# EAGLE board dt-rev-b (EAGLE 9.6.2)
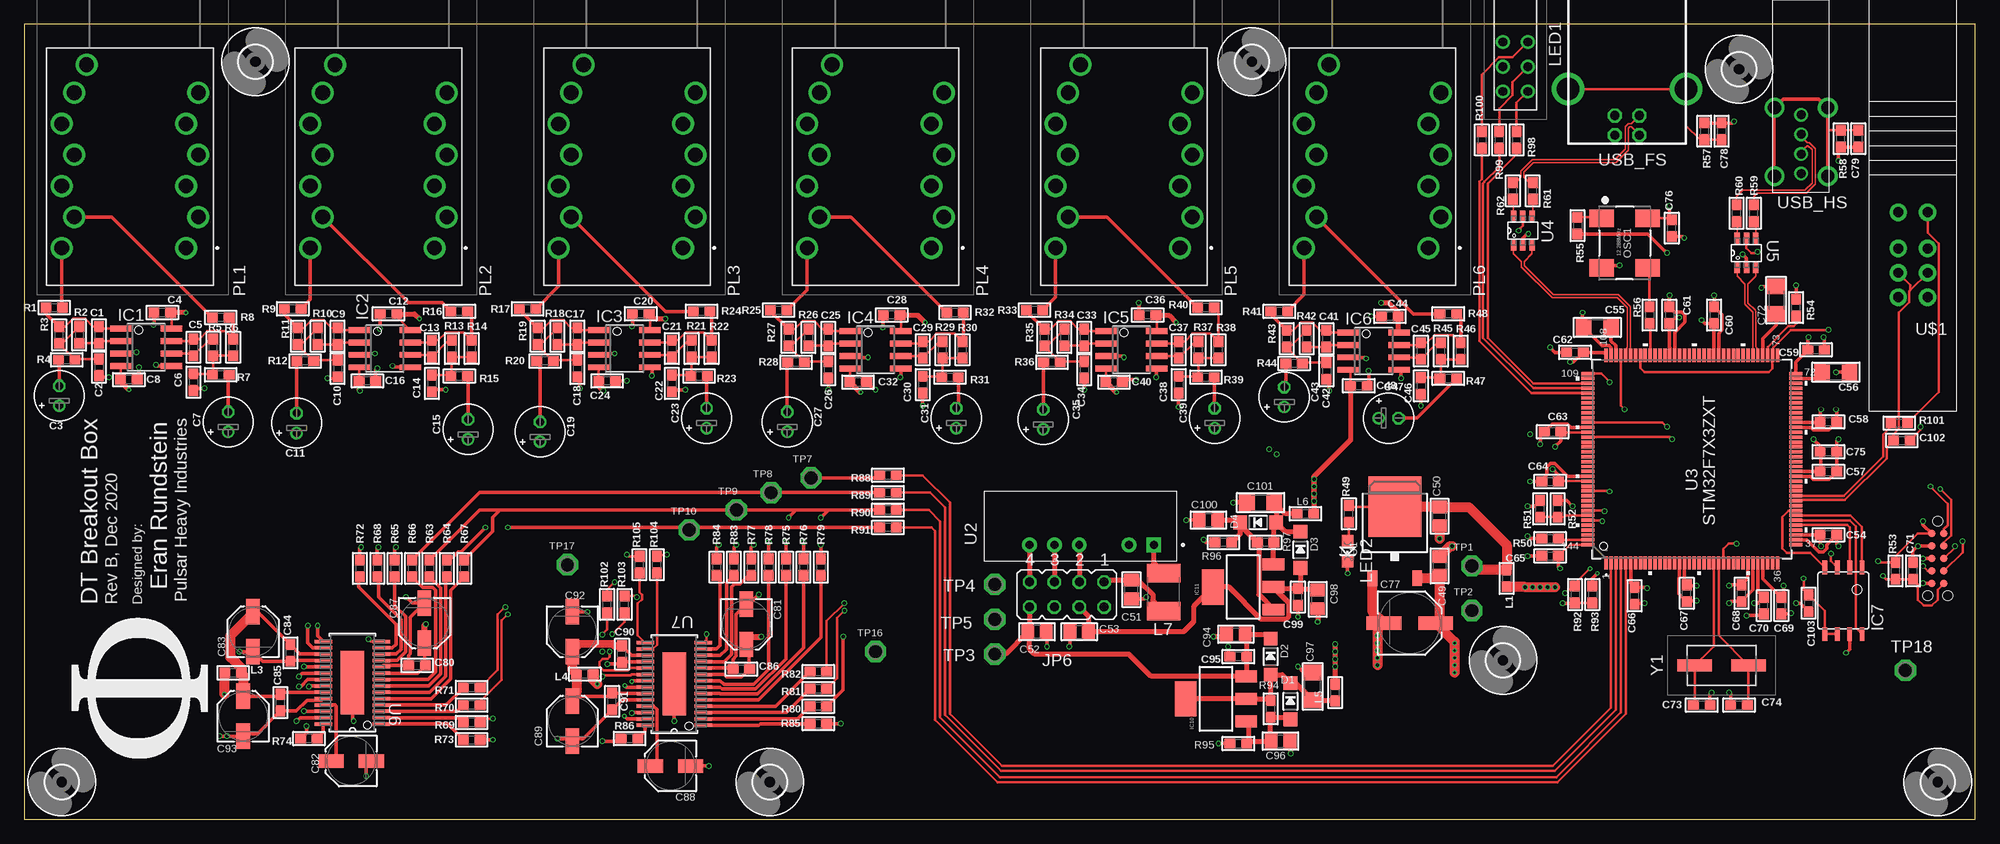
[diagram p4: board, top side]
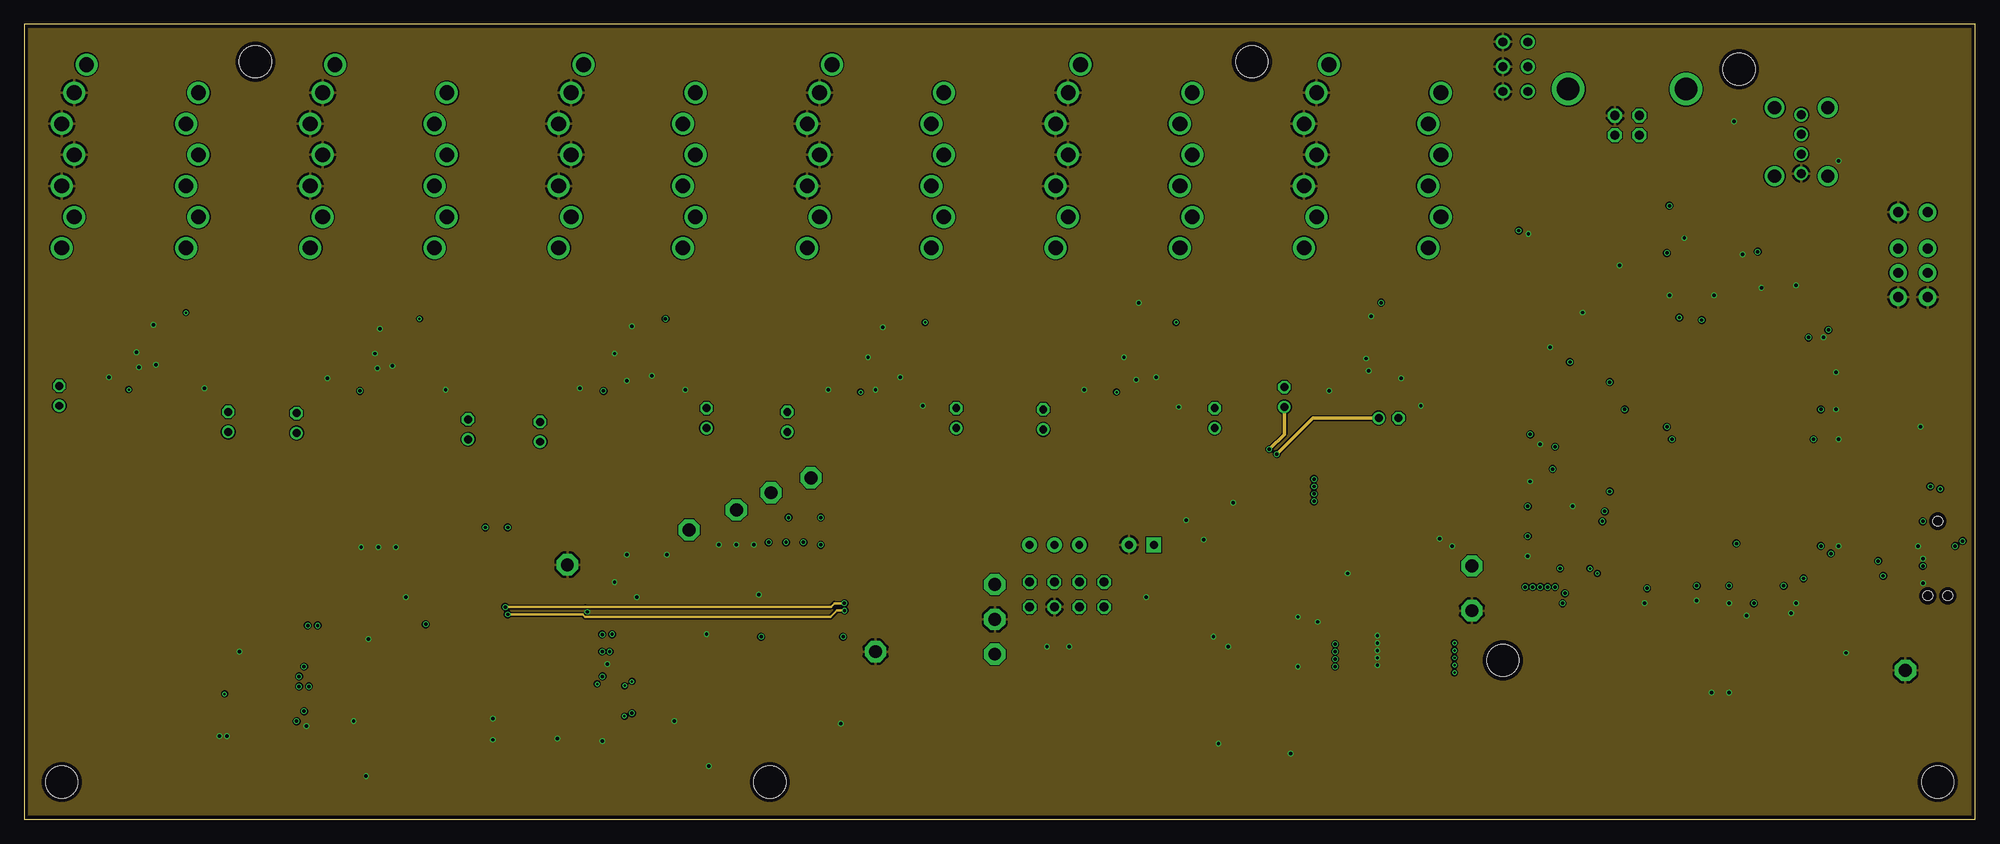
[diagram p5: board, inner layer Route2]
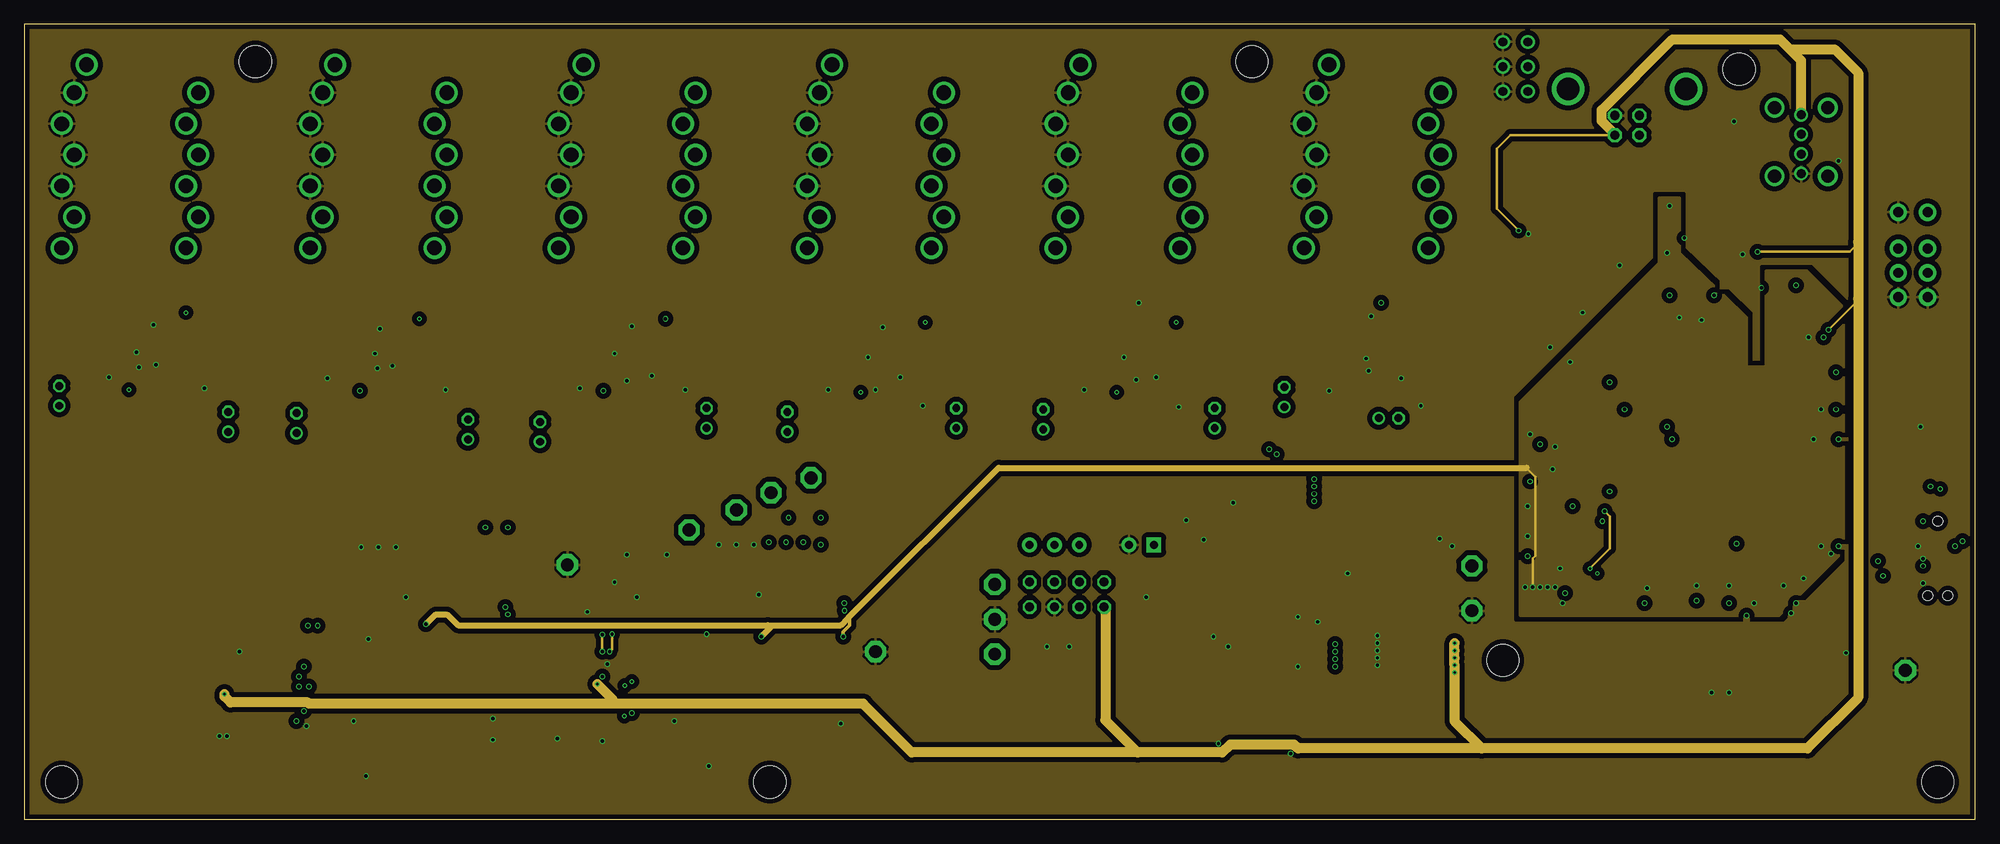
[diagram p6: board, inner layer Route15]
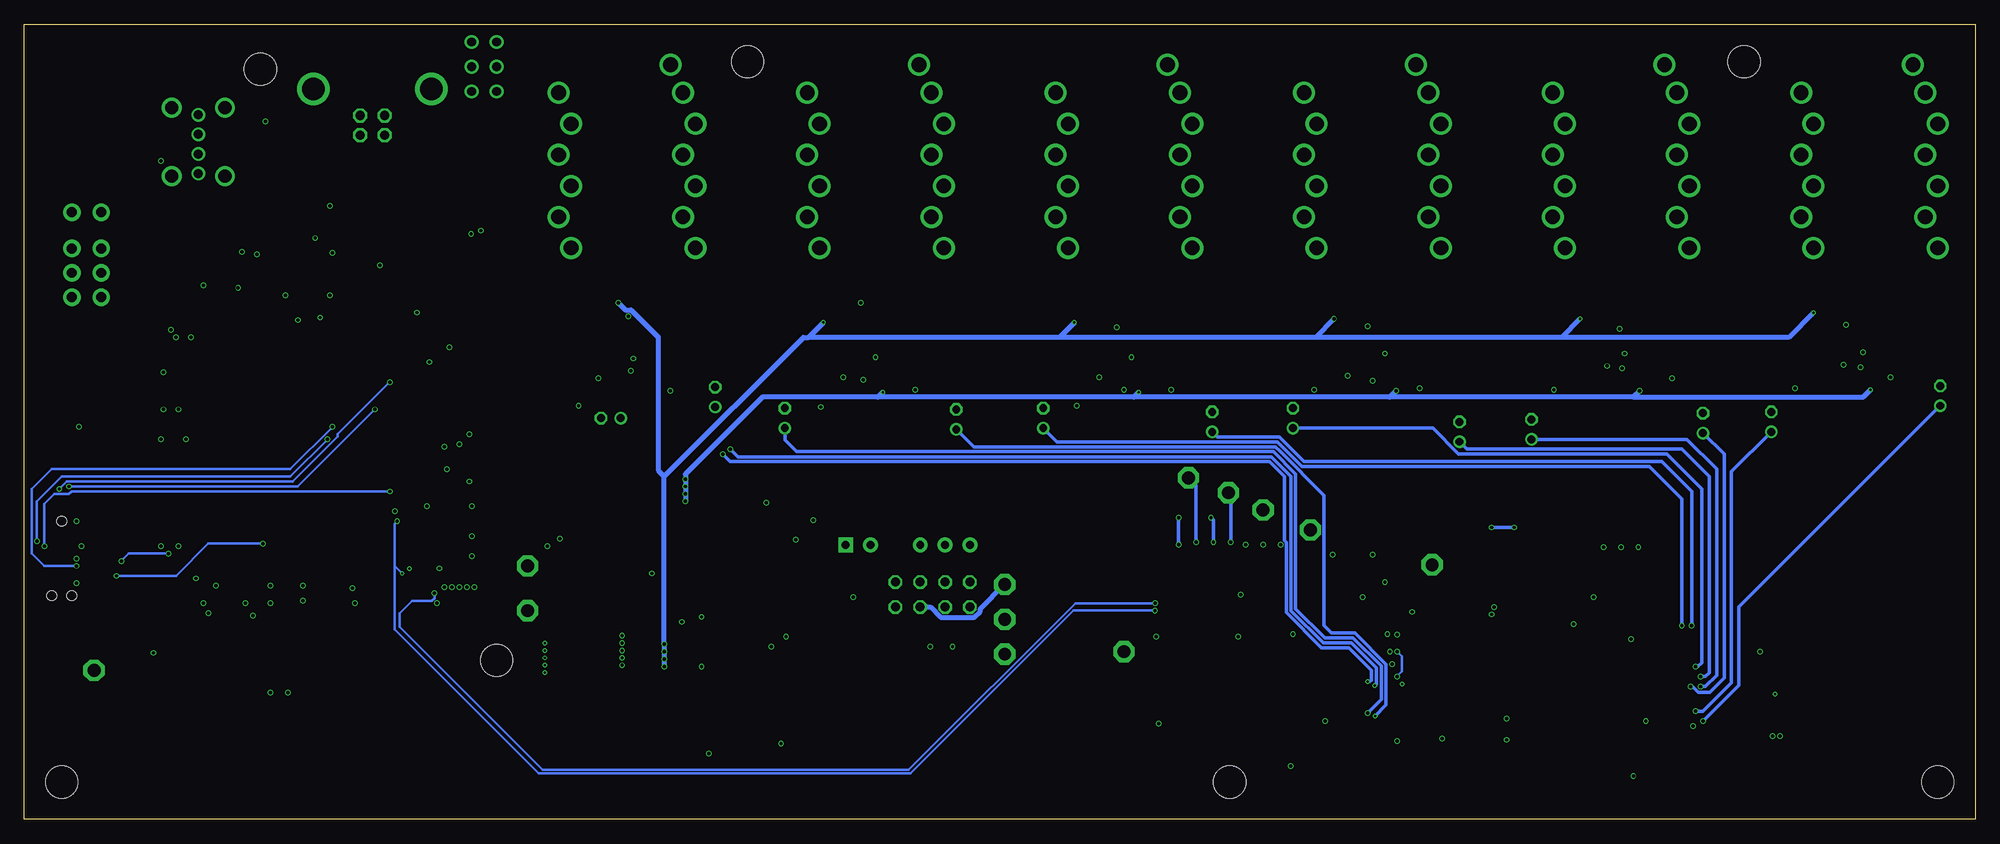
[diagram p7: board, bottom side, seen from below]

Size 199.39 x 81.28 mm. Coordinates in mm from the lower left corner, seen from the top.
Outline: 0,0 199.39,0 199.39,81.28 0,81.28 0,0
Copper layers (1+2*15+16): Top 0.035559375mm / dielectric 0.17018125mm / Route2 0.01778125mm / dielectric 47mil / Route15 0.01778125mm / dielectric 0.17018125mm / Bottom 0.035559375mm
Design rules "oshpark-4layer *": minimum track width 5mil, minimum drill 10mil, track to track 5mil, track to pad 5mil, pad to pad 5mil, via to via 5mil, smd to smd 5mil, copper to edge 15mil, drill to drill 6mil, minimum pad ring 4mil, minimum via ring 4mil, stop-mask expansion 1.5mil, vias tented up to drill 20mil, thermal gap 10mil
Net classes: 1 USB: width 0.152 mm, clearance 0.152 mm

## Footprints (pad centres in the part's own frame; a part is rotated, then mirrored left to right if it is on the bottom)
0603 = smd 1.1 x 1: 1 -0.85,0; 2 0.85,0
E2-5 = drill 0.813 pad 1.27: + -1.016,0 | drill 0.813 pad 1.27 octagon: - 1.016,0
0805 = smd 1.3 x 1.5: 1 -0.95,0; 2 0.95,0
1206 = smd 1.6 x 1.8: 1 -1.4,0; 2 1.4,0
PANASONIC_D = smd 3.556 x 1.4: + 2.654,0; - -2.654,0
PANASONIC_C = smd 2.6 x 1.4: + 2.05,0; - -2.05,0
SOD-123 = smd 1.4 x 1.4: A 1.85,0; C -1.85,0
3,3 = hole 3.3: 0,0
SO08 = smd 0.6 x 2.2: 1 -1.905,-2.6; 2 -0.635,-2.6; 3 0.635,-2.6; 4 1.905,-2.6; 5 1.905,2.6; 6 0.635,2.6; 7 -0.635,2.6; 8 -1.905,2.6
SOIC8 = smd 0.5 x 1.4: 1 -1.905,-3.404; 2 -0.645,-3.404; 3 0.625,-3.404; 4 1.895,-3.404; 5 1.905,3.404; 6 0.635,3.404; 7 -0.635,3.404; 8 -1.905,3.404
SOT223 = smd 1.219 x 2.235: 1 -2.311,-3.099; 2 0,-3.099; 3 2.311,-3.099 | smd 3.6 x 2.2: 4 0,3.099
JP4Q = drill 0.914 octagon: 1 -3.81,-1.27; 2 -3.81,1.27; 3 -1.27,-1.27; 4 -1.27,1.27; 5 1.27,-1.27; 6 1.27,1.27; 7 3.81,-1.27; 8 3.81,1.27
L1812 = smd 1.9 x 3.4: 1 -1.95,0; 2 1.95,0
WP934SALILYLGD = drill 0.889 pad 1.4: A1 5.08,2.54; A2 2.54,2.54; A3 0,2.54; C1 5.08,0; C2 2.54,0; C3 0,0
CHIPLED_0805 = smd 1.2 x 1.2: A 0,-1.05; C 0,1.05
OSC_7X5MM = smd 1.8 x 2.5: 1 -2.54,-2.35; 2 2.54,-2.35; 3 2.54,2.35; 4 -2.54,2.35
NSJ12HF1 = drill 1.5 pad 2.25: 1 0,0; 2 3.18,-1.27; 3 6.35,0; 4 9.53,-1.27; 5 12.7,0; 6 15.874,-1.27; 7 18.75,10.16; 8 15.874,11.43; 9 12.7,12.7; 10 9.53,11.43; 11 6.35,12.7; 12 3.18,11.43; 13 0,12.7
TC2050-IDC-NL = smd 0.787 x 0.787: 1 -2.54,-0.635; 2 -2.54,0.635; 3 -1.27,-0.635; 4 -1.27,0.635; 5 0,-0.635; 6 0,0.635; 7 1.27,-0.635; 8 1.27,0.635; 9 2.54,-0.635; 10 2.54,0.635 | hole 0.991: -3.81,0; 3.81,1.016; 3.81,-1.016
P1-13 = drill 1.321 pad 2.159 octagon: TP 0,0
TO252 = smd 1 x 1.6: 1 -2.28,-4.8; 2 2.28,-4.8 | smd 5.4 x 6.2: 3 0,2.5
CONV_PCN2-S5-D12-S = drill 0.8 pad 1.5 square: 1 0,0 | drill 0.8 pad 1.5: 2 2.54,0; 4 7.62,0; 5 10.16,0; 6 12.7,0
LQFP144-20X20MM = smd 1.346 x 0.356: 1 -10.625,8.75; 2 -10.625,8.25; 3 -10.625,7.75; 4 -10.625,7.25; 5 -10.625,6.75; 6 -10.625,6.25; 7 -10.625,5.75; 8 -10.625,5.25; 9 -10.625,4.75; 10 -10.625,4.25; 11 -10.625,3.75; 12 -10.625,3.25; 13 -10.625,2.75; 14 -10.625,2.25; 15 -10.625,1.75; 16 -10.625,1.25; 17 -10.625,0.75; 18 -10.625,0.25; 19 -10.625,-0.25; 20 -10.625,-0.75; 21 -10.625,-1.25; 22 -10.625,-1.75; 23 -10.625,-2.25; 24 -10.625,-2.75; 25 -10.625,-3.25; 26 -10.625,-3.75; 27 -10.625,-4.25; 28 -10.625,-4.75; 29 -10.625,-5.25; 30 -10.625,-5.75; 31 -10.625,-6.25; 32 -10.625,-6.75; 33 -10.625,-7.25; 34 -10.625,-7.75; 35 -10.625,-8.25; 36 -10.625,-8.75; 73 10.625,-8.75; 74 10.625,-8.25; 75 10.625,-7.75; 76 10.625,-7.25; 77 10.625,-6.75; 78 10.625,-6.25; 79 10.625,-5.75; 80 10.625,-5.25; 81 10.625,-4.75; 82 10.625,-4.25; 83 10.625,-3.75; 84 10.625,-3.25; 85 10.625,-2.75; 86 10.625,-2.25; 87 10.625,-1.75; 88 10.625,-1.25; 89 10.625,-0.75; 90 10.625,-0.25; 91 10.625,0.25; 92 10.625,0.75; 93 10.625,1.25; 94 10.625,1.75; 95 10.625,2.25; 96 10.625,2.75; 97 10.625,3.25; 98 10.625,3.75; 99 10.625,4.25; 100 10.625,4.75; 101 10.625,5.25; 102 10.625,5.75; 103 10.625,6.25; 104 10.625,6.75; 105 10.625,7.25; 106 10.625,7.75; 107 10.625,8.25; 108 10.625,8.75 | smd 0.356 x 1.346: 37 -8.75,-10.625; 38 -8.25,-10.625; 39 -7.75,-10.625; 40 -7.25,-10.625; 41 -6.75,-10.625; 42 -6.25,-10.625; 43 -5.75,-10.625; 44 -5.25,-10.625; 45 -4.75,-10.625; 46 -4.25,-10.625; 47 -3.75,-10.625; 48 -3.25,-10.625; 49 -2.75,-10.625; 50 -2.25,-10.625; 51 -1.75,-10.625; 52 -1.25,-10.625; 53 -0.75,-10.625; 54 -0.25,-10.625; 55 0.25,-10.625; 56 0.75,-10.625; 57 1.25,-10.625; 58 1.75,-10.625; 59 2.25,-10.625; 60 2.75,-10.625; 61 3.25,-10.625; 62 3.75,-10.625; 63 4.25,-10.625; 64 4.75,-10.625; 65 5.25,-10.625; 66 5.75,-10.625; 67 6.25,-10.625; 68 6.75,-10.625; 69 7.25,-10.625; 70 7.75,-10.625; 71 8.25,-10.625; 72 8.75,-10.625; 109 8.75,10.625; 110 8.25,10.625; 111 7.75,10.625; 112 7.25,10.625; 113 6.75,10.625; 114 6.25,10.625; 115 5.75,10.625; 116 5.25,10.625; 117 4.75,10.625; 118 4.25,10.625; 119 3.75,10.625; 120 3.25,10.625; 121 2.75,10.625; 122 2.25,10.625; 123 1.75,10.625; 124 1.25,10.625; 125 0.75,10.625; 126 0.25,10.625; 127 -0.25,10.625; 128 -0.75,10.625; 129 -1.25,10.625; 130 -1.75,10.625; 131 -2.25,10.625; 132 -2.75,10.625; 133 -3.25,10.625; 134 -3.75,10.625; 135 -4.25,10.625; 136 -4.75,10.625; 137 -5.25,10.625; 138 -5.75,10.625; 139 -6.25,10.625; 140 -6.75,10.625; 141 -7.25,10.625; 142 -7.75,10.625; 143 -8.25,10.625; 144 -8.75,10.625
SOT23-6L_STM-M = smd 1.181 x 0.559: 1 -1.467,0.95; 2 -1.467,0; 3 -1.467,-0.95; 4 1.467,-0.95; 5 1.467,0; 6 1.467,0.95
PWP28_6P46X2P4-M = smd 1.778 x 0.356: 1 -2.972,4.225; 2 -2.972,3.575; 3 -2.972,2.925; 4 -2.972,2.275; 5 -2.972,1.625; 6 -2.972,0.975; 7 -2.972,0.325; 8 -2.972,-0.325; 9 -2.972,-0.975; 10 -2.972,-1.625; 11 -2.972,-2.275; 12 -2.972,-2.925; 13 -2.972,-3.575; 14 -2.972,-4.225; 15 2.972,-4.225; 16 2.972,-3.575; 17 2.972,-2.925; 18 2.972,-2.275; 19 2.972,-1.625; 20 2.972,-0.975; 21 2.972,-0.325; 22 2.972,0.325; 23 2.972,0.975; 24 2.972,1.625; 25 2.972,2.275; 26 2.972,2.925; 27 2.972,3.575; 28 2.972,4.225 | smd 2.4 x 6.46: 29 0,0
WBL2UOAGQ = drill 1.016 pad 1.778: LED+ -6.2,1.5; LED- -6.2,-1.5; P$1 -2.5,-1.5; P$2 0,-1.5; P$3 2.5,-1.5; P$4 -2.5,1.5; P$5 0,1.5; P$6 2.5,1.5
TE-292304-1 = drill 0.95 octagon: 1 1.25,4.71; 2 -1.25,4.71; 3 -1.25,2.71; 4 1.25,2.71 | drill 2.3: P$1 6.02,0; P$2 -6.02,0
FCI-73725-0110BLF = drill 1.35: M1 -2.72,-6.73; M2 2.72,0.27; M3 -2.72,0.27; M4 2.72,-6.73 | drill 0.92: P$1 0,-6; P$2 0,-4; P$3 0,-2; P$4 0,0
ABLS7M225000MHZD2YT = smd 3.5 x 1.2: 1 -2.75,0; 2 2.75,0

## Placement (x,y rotation side)
C1  470pF  [0603]  7.62,49.53 270 top
C2  4700pF  [0603]  7.62,46.23 270 top
C3  100u  [E2-5]  3.56,43.31 90 top
C4  100n  [0603]  14.1,51.82 180 top
C5  470pF  [0603]  17.27,48.26 270 top
C6  4700pF  [0603]  17.27,44.7 270 top
C7  100u  [E2-5]  20.83,40.64 90 top
C8  100n  [0603]  10.67,44.96 180 top
C9  470pF  [0603]  32,49.4 270 top
C10  4700pF  [0603]  32,46.1 270 top
C11  100u  [E2-5]  27.81,40.51 90 top
C12  100n  [0603]  37.21,51.69 180 top
C13  470pF  [0603]  41.66,48.13 270 top
C14  4700pF  [0603]  41.66,44.58 270 top
C15  100u  [E2-5]  45.34,39.88 90 top
C16  100n  [0603]  35.05,44.83 180 top
C17  470pF  [0603]  56.52,49.4 270 top
C18  4700pF  [0603]  56.52,46.1 270 top
C19  100u  [E2-5]  52.7,39.62 90 top
C20  100n  [0603]  62.99,51.69 180 top
C21  470pF  [0603]  66.17,48.13 270 top
C22  4700pF  [0603]  66.17,44.58 270 top
C23  100u  [E2-5]  69.72,41.02 90 top
C24  100n  [0603]  59.56,44.83 180 top
C25  470pF  [0603]  82.17,49.28 270 top
C26  4700pF  [0603]  82.17,45.97 270 top
C27  100u  [E2-5]  77.98,40.64 90 top
C28  100n  [0603]  88.65,51.56 180 top
C29  470pF  [0603]  91.82,48.01 270 top
C30  4700pF  [0603]  91.82,44.45 270 top
C31  100u  [E2-5]  95.25,41.02 90 top
C32  100n  [0603]  85.22,44.7 180 top
C33  470pF  [0603]  108.33,49.28 270 top
C34  4700pF  [0603]  108.33,45.97 270 top
C35  100u  [E2-5]  104.14,40.89 90 top
C36  100n  [0603]  114.81,51.56 180 top
C37  470pF  [0603]  117.98,48.01 270 top
C38  4700pF  [0603]  117.98,44.45 270 top
C39  100u  [E2-5]  121.67,41.02 90 top
C40  100n  [0603]  111.38,44.7 180 top
C41  470pF  [0603]  133.1,49.15 270 top
C42  4700pF  [0603]  133.1,45.85 270 top
C43  100u  [E2-5]  128.78,43.18 90 top
C44  100n  [0603]  139.57,51.44 180 top
C45  470pF  [0603]  142.75,47.88 270 top
C46  4700pF  [0603]  142.75,44.32 270 top
C47  100u  [E2-5]  139.45,41.02 0 top
C48  100n  [0603]  136.4,44.32 180 top
C49  10u  [0805]  144.65,25.91 270 top
C50  10u  [0805]  144.65,30.99 90 top
C51  10u  [0805]  113.16,23.5 90 top
C52  10u  [0805]  103.5,19.18 180 top
C53  10u  [0805]  107.82,19.18 0 top
C54  100n  [0603]  184.4,29.08 180 top
C55  2.2u  [1206]  160.78,50.29 0 top
C56  2.2u  [1206]  185.17,45.72 180 top
C57  100n  [0603]  184.4,35.56 180 top
C58  100n  [0603]  184.4,40.64 180 top
C59  100n  [0603]  183.13,48.01 180 top
C60  100n  [0603]  172.72,51.56 270 top
C61  100n  [0603]  168.15,51.56 270 top
C62  100n  [0603]  158.5,47.75 0 top
C63  100n  [0603]  156.21,39.62 0 top
C64  100n  [0603]  155.96,34.54 0 top
C65  100n  [0603]  155.96,26.92 0 top
C66  100n  [0603]  164.59,22.86 90 top
C67  100n  [0603]  169.93,23.11 90 top
C68  100n  [0603]  175.51,23.11 90 top
C69  100n  [0603]  179.58,21.84 90 top
C70  100n  [0603]  177.8,21.84 90 top
C71  100n  [0603]  193.04,25.4 90 top
C72  2.2u  [1206]  179.07,53.09 270 top
C73  18pF  [0603]  171.45,11.68 0 top
C74  18pF  [0603]  175.26,11.68 0 top
C75  4.7u  [0603]  184.4,37.59 180 top
C76  100n  [0603]  168.4,60.45 90 top
C77  100u  [PANASONIC_D]  141.6,20.07 0 top
C78  4700pF  [0603]  173.48,70.36 270 top
C79  4700pF  [0603]  187.45,69.6 90 top
C80  1u Ceramic  [0603]  40.13,15.75 0 top
C81  10u Electrolyte  [PANASONIC_C]  73.79,19.94 270 top
C82  10u Electrolyte  [PANASONIC_C]  33.4,5.97 180 top
C83  10u Electrolyte  [PANASONIC_C]  23.37,19.18 90 top
C84  1u Ceramic  [0603]  27.18,17.02 90 top
C85  1u Ceramic  [0603]  26.16,11.94 90 top
C86  1u Ceramic  [0603]  73.28,15.37 0 top
C87  10u Electrolyte  [PANASONIC_C]  40.89,20.07 270 top
C88  10u Electrolyte  [PANASONIC_C]  66.04,5.46 180 top
C89  10u Electrolyte  [PANASONIC_C]  56.01,10.03 90 top
C90  1u Ceramic  [0603]  61.09,16.89 90 top
C91  1u Ceramic  [0603]  60.07,12.06 90 top
C92  10u Electrolyte  [PANASONIC_C]  56.01,19.18 270 top
C93  10u Electrolyte  [PANASONIC_C]  22.35,10.54 90 top
C94  2.2u  [0805]  123.83,18.92 0 top
C95  100n  [0603]  124.08,16.64 180 top
C96  10u  [0805]  128.4,8 0 top
C97  1u  [1206]  131.7,13.59 90 top
C98  2.2u  [0805]  132.21,22.48 270 top
C99  100n  [0603]  130.18,22.73 90 top
C100  10u  [0805]  121.03,30.61 0 top
C101  1u  [1206]  126.36,32.38 0 top
C102  100n  [0603]  191.9,38.73 0 top
C103  100n  [0603]  182.37,22.1 270 top
D1  MBR120LSFT3G  [SOD-123]  129.41,12.06 270 top
D2  MBR120LSFT3G  [SOD-123]  127.38,16.64 270 top
D3  MBR120LSFT3G  [SOD-123]  130.43,27.56 270 top
D4  MBR120LSFT3G  [SOD-123]  126.11,30.35 0 top
H1  MOUNT-HOLE3.3  [3,3]  23.62,77.47 0 top
H2  MOUNT-HOLE3.3  [3,3]  125.48,77.47 0 top
H3  MOUNT-HOLE3.3  [3,3]  195.58,3.81 0 top
H4  MOUNT-HOLE3.3  [3,3]  3.81,3.81 0 top
H5  MOUNT-HOLE3.3  [3,3]  175.26,76.71 0 top
H6  MOUNT-HOLE3.3  [3,3]  76.2,3.81 0 top
H7  MOUNT-HOLE3.3  [3,3]  151.13,16.26 0 top
IC1  TL072D  [SO08]  12.45,48.26 270 top
IC2  TL072D  [SO08]  36.83,48.13 270 top
IC3  TL072D  [SO08]  61.34,48.13 270 top
IC4  TL072D  [SO08]  87,48.01 270 top
IC5  TL072D  [SO08]  113.16,48.01 270 top
IC6  TL072D  [SO08]  137.92,47.88 270 top
IC7  AT45DB161D-SU  [SOIC8]  185.93,22.35 180 top
IC10  LM317  [SOT223]  121.79,12.32 90 top
IC11  LM337  [SOT223]  124.59,23.75 90 top
JP6  [JP4Q]  106.55,22.99 180 top
L1  600ohm @ 100MHz  [0603]  151.51,24.64 270 top
L3  600ohm @ 100MHz  [0603]  21.34,14.99 0 top
L4  600ohm @ 100MHz  [0603]  57.28,14.86 180 top
L5  600ohm @ 100MHz  [0603]  133.99,12.95 90 top
L6  600ohm @ 100MHz  [0603]  130.94,31.24 0 top
L7  5.6uH  [L1812]  116.46,23.24 90 top
LED1  WP934SA_LILYLGDLED  [WP934SALILYLGD]  151.13,79.5 270 top
LED2  [CHIPLED_0805]  135.25,27.43 180 top
OSC1  12.288MHz  [OSC_7X5MM]  163.58,58.93 270 top
PL1  NSJ12HC  [NSJ12HF1]  16.51,58.42 90 top
PL2  NSJ12HC  [NSJ12HF1]  41.91,58.42 90 top
PL3  NSJ12HC  [NSJ12HF1]  67.31,58.42 90 top
PL4  NSJ12HC  [NSJ12HF1]  92.71,58.42 90 top
PL5  NSJ12HC  [NSJ12HF1]  118.11,58.42 90 top
PL6  NSJ12HC  [NSJ12HF1]  143.51,58.42 90 top
R1  47  [0603]  3.05,52.32 0 top
R2  560  [0603]  5.59,49.53 270 top
R3  8.2k  [0603]  3.56,49.53 90 top
R4  51k  [0603]  4.32,46.99 180 top
R5  560  [0603]  19.3,48.26 90 top
R6  8.2k  [0603]  21.34,48.26 90 top
R7  51k  [0603]  20.07,45.47 0 top
R8  47  [0603]  20.07,51.31 180 top
R9  47  [0603]  27.43,52.2 0 top
R10  560  [0603]  29.97,49.4 270 top
R11  8.2k  [0603]  27.94,49.4 90 top
R12  51k  [0603]  28.7,46.86 180 top
R13  560  [0603]  43.69,48.13 90 top
R14  8.2k  [0603]  45.72,48.13 90 top
R15  51k  [0603]  44.45,45.34 0 top
R16  47  [0603]  44.45,51.94 180 top
R17  47  [0603]  51.44,52.2 0 top
R18  560  [0603]  54.48,49.4 270 top
R19  8.2k  [0603]  52.45,49.4 90 top
R20  51k  [0603]  53.21,46.86 180 top
R21  560  [0603]  68.2,48.13 90 top
R22  8.2k  [0603]  70.23,48.13 90 top
R23  51k  [0603]  68.96,45.34 0 top
R24  47  [0603]  69.22,51.94 180 top
R25  47  [0603]  77.09,52.07 0 top
R26  560  [0603]  80.14,49.28 270 top
R27  8.2k  [0603]  78.11,49.28 90 top
R28  51k  [0603]  78.87,46.74 180 top
R29  560  [0603]  93.85,48.01 90 top
R30  8.2k  [0603]  95.89,48.01 90 top
R31  51k  [0603]  94.61,45.21 0 top
R32  47  [0603]  95.12,51.82 180 top
R33  47  [0603]  103.25,52.07 0 top
R34  560  [0603]  106.3,49.28 270 top
R35  8.2k  [0603]  104.27,49.28 90 top
R36  51k  [0603]  105.03,46.74 180 top
R37  560  [0603]  120.02,48.01 90 top
R38  8.2k  [0603]  122.05,48.01 90 top
R39  51k  [0603]  120.78,45.21 0 top
R40  47  [0603]  120.78,52.32 180 top
R41  47  [0603]  128.27,51.94 0 top
R42  560  [0603]  131.06,49.15 270 top
R43  8.2k  [0603]  129.03,49.15 90 top
R44  51k  [0603]  129.79,46.61 180 top
R45  560  [0603]  144.78,47.88 90 top
R46  8.2k  [0603]  146.81,47.88 90 top
R47  51k  [0603]  145.54,45.09 0 top
R48  47  [0603]  145.54,51.69 180 top
R49  1k  [0603]  135.38,31.24 90 top
R50  10k  [0603]  155.96,28.7 0 top
R51  10k  [0603]  154.94,31.75 90 top
R52  10k  [0603]  156.72,31.75 90 top
R53  10k  [0603]  191.26,25.4 90 top
R54  3k 1%  [0603]  181.1,52.32 90 top
R55  10k  [0603]  158.75,60.71 270 top
R56  0  [0603]  166.12,51.56 270 top
R57  1M  [0603]  171.7,70.36 270 top
R58  1M  [0603]  185.67,69.6 90 top
R59  0  [0603]  176.78,61.98 90 top
R60  0  [0603]  175.01,61.98 90 top
R61  0  [0603]  154.18,64.26 90 top
R62  0  [0603]  152.15,64.26 90 top
R63  0  [0603]  41.4,25.65 270 top
R64  0  [0603]  43.18,25.65 270 top
R65  22  [0603]  37.85,25.65 270 top
R66  0  [0603]  39.62,25.65 270 top
R67  0  [0603]  44.96,25.65 270 top
R68  22  [0603]  36.07,25.65 270 top
R69  0  [0603]  45.72,9.91 180 top
R70  0  [0603]  45.72,11.68 180 top
R71  0  [0603]  45.72,13.46 180 top
R72  22  [0603]  34.29,25.65 270 top
R73  22  [0603]  45.72,8.13 0 top
R74  22  [0603]  29.08,8.26 180 top
R75  0  [0603]  77.85,25.78 270 top
R76  0  [0603]  79.63,25.78 270 top
R77  22  [0603]  74.3,25.78 270 top
R78  0  [0603]  76.07,25.78 270 top
R79  0  [0603]  81.41,25.78 270 top
R80  0  [0603]  81.15,11.56 180 top
R81  0  [0603]  81.15,13.34 180 top
R82  0  [0603]  81.15,15.11 180 top
R83  22  [0603]  72.52,25.78 270 top
R84  22  [0603]  70.74,25.78 270 top
R85  22  [0603]  81.15,9.78 0 top
R86  22  [0603]  61.85,8.26 180 top
R88  22  [0603]  88.27,35.18 180 top
R89  22  [0603]  88.27,33.4 180 top
R90  22  [0603]  88.27,31.62 180 top
R91  22  [0603]  88.27,29.84 180 top
R92  4.7k  [0603]  158.5,22.99 270 top
R93  4.7k  [0603]  160.27,22.99 270 top
R94  240 0.1%  [0603]  127.38,11.3 90 top
R95  2.2k 0.1%  [0603]  124.08,7.75 0 top
R96  2.2k 0.1%  [0603]  122.56,28.32 180 top
R97  240 0.1%  [0603]  126.87,28.32 180 top
R98  1k  [0603]  152.53,69.47 270 top
R99  1k  [0603]  150.75,69.47 270 top
R100  1k  [0603]  148.97,69.47 270 top
R101  1k  [0603]  191.64,40.51 0 top
R102  1k  [0603]  59.56,21.97 90 top
R103  1k  [0603]  61.34,21.97 90 top
R104  1k  [0603]  64.64,26.04 90 top
R105  1k  [0603]  62.87,26.04 90 top
TC1  TC2050-IDC-NL  [TC2050-IDC-NL]  195.58,26.67 270 top
TP1  TPPAD1-13  [P1-13]  147.96,25.91 0 top
TP2  TPPAD1-13  [P1-13]  147.96,21.34 0 top
TP3  TPPAD1-13  [P1-13]  99.19,16.89 180 top
TP4  TPPAD1-13  [P1-13]  99.19,24 180 top
TP5  TPPAD1-13  [P1-13]  99.19,20.45 180 top
TP7  TPPAD1-13  [P1-13]  80.39,34.92 0 top
TP8  TPPAD1-13  [P1-13]  76.33,33.4 0 top
TP9  TPPAD1-13  [P1-13]  72.77,31.62 0 top
TP10  TPPAD1-13  [P1-13]  67.94,29.59 0 top
TP16  TPPAD1-13  [P1-13]  87,17.14 0 top
TP17  TPPAD1-13  [P1-13]  55.5,26.04 0 top
TP18  TPPAD1-13  [P1-13]  192.28,15.24 0 top
U1  LM1117DTX-3.3  [TO252]  140.08,29.46 0 top
U2  PCN2-S5-D15-S  [CONV_PCN2-S5-D12-S]  115.44,28.07 180 top
U3  STM32F7X3ZXT  [LQFP144-20X20MM]  170.43,36.83 90 top
U4  USBLC6-2SC6YSOT23-6L_STM-M  [SOT23-6L_STM-M]  153.16,60.2 90 top
U5  USBLC6-2SC6YSOT23-6L_STM-M  [SOT23-6L_STM-M]  176.02,57.91 90 top
U6  PCM1681PWPPWP28_6P46X2P4-M  [PWP28_6P46X2P4-M]  33.53,13.97 180 top
U7  PCM1681PWPPWP28_6P46X2P4-M  [PWP28_6P46X2P4-M]  66.42,13.84 180 top
U$1  WBL2UOAGQR05CLR  [WBL2UOAGQ]  193.04,55.88 270 top
U$2  PHI-LOGO  [PHI-LOGO]  11.05,13.84 180 top
USB_FS  [TE-292304-1]  163.83,74.68 180 top
USB_HS  FCI-73725-0110BLF  [FCI-73725-0110BLF]  181.61,66.04 180 top
Y1  ABLS7M2-25.000MHZ-D2Y-T  [ABLS7M225000MHZD2YT]  173.48,15.75 0 top

## Tracks (layer width: path | path; a pad name or v marks a point on that pad's centre or on a via)
+3V3  (via drill 0.35)
  Top 0.254: U3.121 157.1,39.58 C63.2 | U3.131 156.84,34.58 C64.2 | U3.144 157.96,28.08 C65.2 | TC1.1 193.55,29.21 191.26,26.92 R53.2 189.65,26.25 v189.48,26.42 | OSC1.4 168.24,61.47 C76.2 | R92.2 R93.2 | IC7.6 IC7.5 184.02,21.3 C103.1 181.86,23.46 v181.86,24.64 | IC7.3 184.66,26.4 v184.66,27.18
  Top 0.356: C64.2 156.81,35.22 v156.21,35.81 | C63.2 157.06,38.7 v156.46,38.1 | v157.99,46.76 158.01,46.74 158.33,46.74 C62.2 161.39,47.75 U3.108 | R51.2 154.34,32 v153.67,32 | R50.1 153.92,28.7 v153.67,28.96 | C65.2 156.81,25.82 v156.97,25.65 | R92.2 158.46,22.1 v157.23,22.1 | U3.6 164.18,24.12 C66.2 165.77,23.71 v165.86,23.62 | U3.17 169.68,24.21 C67.2 170.01,23.88 v170.94,23.88 | U3.30 176.18,24.63 C68.2 174.33,23.96 v174.24,23.88 | U3.32 177.18,23.31 C70.2 177.2,22.1 v176.78,22.1 | U3.33 177.68,24.59 C69.2 179.83,22.95 v179.83,23.88 | U3.39 C54.2 183.55,28.03 v183.64,27.94 | U3.52 183.53,35.58 | 183.53,35.58 C57.2 | U3.62 183.49,40.58 C58.2 183.55,41.82 v183.64,41.91 | 183.53,35.58 183.64,35.69 183.64,37.5 C75.2 183.55,38.19 v182.88,38.86 | U3.72 181.06,46.78 C59.2 182.28,49.19 v182.37,49.28 | U3.86 172.68,50.68 C60.2 171.79,50.71 v171.45,51.05 | U3.95 168.17,47.47 168.17,48.25 168.15,48.27 C61.2 168.74,51.31 v169.16,51.31 | C76.2 168.15,61.56 v168.15,62.74 | R55.2 165.95,59.86 v167.89,57.91 | TC1.1 194.06,30.1 v194.06,30.48 | U6.9 38.6,14.95 38.61,14.94 40.18,14.94 C80.2 40.89,15.84 C87.+ | U7.9 71.5,14.82 71.75,14.56 73.32,14.56 C86.2 74.06,15.44 74.06,18.16 74.06,18.67 | R80.1 83.69,13.25 v83.69,18.67
  Top 0.61: C81.+ 74.06,18.16 | 74.06,18.67 v75.31,18.67 | C87.+ 40.89,19.81 v41.02,19.94
  Top 1.016: v156.46,23.75 v155.7,23.75 v154.94,23.75 v154.18,23.75 v153.42,23.75 151.55,23.75 L1.2
  Route15 0.254: v154.18,23.75 154.18,26.68 154.46,26.96 154.46,35.03 153.54,35.94
  Route15 0.356: v83.69,18.67 83.69,19.18 84.33,19.81 84.33,20.45 84.2,20.57
  Route15 0.61: v75.31,18.67 76.22,19.58 75.97,19.84 | v41.02,19.94 42.04,20.95 43.2,20.95 44.32,19.84 75.97,19.84 | 75.97,19.84 83.46,19.84 84.2,20.57 99.57,35.94 153.54,35.94
  Bottom 0.254: v189.48,26.42 188.72,27.18 v184.66,27.18
  other vias: 153.92,39.37
  pour Route15 (isolate 0.508): 152.91,20.83 179.32,20.83 185.93,27.43 185.93,52.32 182.2,56.05 178.05,56.05 178.05,46.23 176.02,46.23 176.02,51.31 175.51,51.82 169.16,57.91 169.16,63.5 167.13,63.5 167.13,56.9 152.91,42.67
+5V  (via drill 0.25, 0.35)
  Top 0.254: U3.101 165.18,46.14 165.61,45.72 178.31,45.72 178.68,46.1 U3.74 178.75,47.52 178.75,48.23 180.56,50.04 v184.4,50.04 | U4.5 153.16,60.71 152.91,60.45 152.91,60.36 v152.75,60.2 | U5.5 176.02,58.42 176.53,57.91 177.16,57.91 v177.16,58.04
  Top 1.016: U1.2 144.36,24.66 C49.2 144.65,20.46 C77.+ 146.18,18.15 v146.18,18.03 v146.18,17.27 v146.18,16.51 v146.18,15.75 v146.18,14.99 | v20.45,12.83 20.45,14.95 L3.1 | L4.1 58.13,14.26 v58.55,13.84
  Route15 0.254: v152.75,60.2 150.5,62.45 150.5,68.58 151.88,69.97 USB_FS.1 | v177.16,58.04 186.56,58.04 187.45,58.93 187.45,59.05 | v184.4,50.04 187.45,53.09 187.45,53.21
  Route15 1.016: v146.18,15.75 v146.18,14.99 | v146.18,15.75 v146.18,16.51 v146.18,17.27 v146.18,18.03 | v20.45,12.83 20.45,12.57 21.06,11.96 28.95,11.96 29.1,11.81 60.07,11.81 | v58.55,13.84 60.07,12.32 60.07,11.81 | 60.07,11.81 85.72,11.81 90.7,6.83 113.79,6.83 | USB_FS.1 162.58,70.06 161.23,71.41 161.23,72.52 168.46,79.76 179.45,79.76 180.47,78.74 | 180.47,78.74 185.04,78.74 187.45,76.33 187.45,59.05 187.45,53.21 187.45,12.45 182.25,7.24 148.97,7.24 | USB_HS.P$1 181.61,77.6 180.47,78.74 | 148.97,7.24 130.19,7.24 129.79,7.64 123.23,7.64 122.42,6.83 113.79,6.83 | 148.97,7.24 146.18,10.03 v146.18,15.75 | JP6.2 110.49,21.59 110.49,10.14 113.79,6.83
+12V  (via drill 0.25, 0.35)
  Top 0.254: IC1.8 15.05,51.72 C4.1 | IC2.8 38.06,51.41 C12.1 | IC3.8 63.94,51.59 C20.1 | IC4.8 89.59,51.46 C28.1 | IC5.8 115.76,51.46 C36.1
  Top 0.508: v16.51,51.82 C4.1 | C12.1 39.88,51.69 v40.39,51.18 | C28.1 91.31,51.56 v92.08,50.8 | C36.1 116.97,51.56 v117.73,50.8 | L5.2 v133.99,15.62 v133.99,16.38 v133.99,17.14 v133.99,17.91 | C20.1 64.35,51.18 v65.53,51.18 | v138.68,52.83 139.45,52.83 140.42,51.85 C44.1 140.42,49.88 IC6.8
  Bottom 0.508: v92.08,50.8 93.6,49.28 | 119.25,49.28 v117.73,50.8 | v133.99,15.62 v133.99,16.38 v133.99,17.14 v133.99,17.91 133.99,35.05 | 119.25,49.28 119.76,49.28 133.99,35.05 | 93.6,49.28 119.25,49.28 | v65.53,51.18 67.44,49.28 | 67.44,49.28 93.6,49.28 | 42.29,49.28 67.44,49.28 | v40.39,51.18 42.29,49.28 | v16.51,51.82 19.05,49.28 42.29,49.28 | v138.68,52.83 137.94,52.09 137.4,52.09 134.62,49.32 134.62,35.69 133.99,35.05
+15V
  Top 0.508: JP6.8 102.74,19.36 | 102.74,19.36 C52.2 100.27,16.89 TP3.TP | D2.C 126.94,18.92 C94.2 124.93,18.77 C95.1 124.93,14.67 IC10.3 115.16,14.63 112.9,16.89 103.25,16.89 102.74,17.4 102.74,19.36
-12V  (via drill 0.25, 0.35)
  Top 0.254: C32.2 84.37,46.07 IC4.4 | C40.2 110.53,46.07 IC5.4 | IC6.4 135.55,45.75 C48.2 | C24.2 58.71,46.2 IC3.4 | C16.2 34.2,46.2 IC2.4 | C8.2 9.82,46.33 IC1.4
  Top 0.508: v10.67,43.94 9.82,44.79 C8.2 | C32.2 85.38,43.69 v85.47,43.69 | C40.2 111.55,43.69 v111.63,43.69 | v131.83,32.51 v131.83,33.27 v131.83,34.04 v131.83,34.8 131.83,35.05 | 131.83,35.05 131.79,35.01 L6.2 | C48.2 135.55,38.77 131.83,35.05 | C24.2 58.71,44.28 v59.18,43.81 | C16.2 34.2,43.9 v34.29,43.81
  Bottom 0.508: v111.63,43.69 112.14,43.18 | 112.14,43.18 123.95,43.18 131.83,35.31 v131.83,34.8 v131.83,34.04 v131.83,33.27 v131.83,32.51 | v85.47,43.69 85.98,43.18 | 85.98,43.18 112.14,43.18 | v59.18,43.81 59.82,43.18 | 59.82,43.18 85.98,43.18 | v34.29,43.81 34.92,43.18 | 34.92,43.18 59.82,43.18 | v10.67,43.94 11.43,43.18 34.92,43.18
-15V
  Top 0.508: IC11.2 127.69,23.7 127.81,23.58 | 127.81,23.58 129.18,22.2 129.18,20.67 128.96,20.45 126.41,20.45 123.11,23.75 IC11.4 119.51,21.77 119.51,20.19 118.49,19.18 C53.2 108.77,20.77 JP6.4 | C99.2 127.81,23.58 | D3.A 130.43,23.84 C99.2 | C99.2 132.05,23.58 C98.1
  Bottom 0.508: JP6.4 106.79,21.72 105.72,20.65 102.3,20.65 101.68,21.27 101.68,21.51 TP4.TP
DAC_OUT1  (via drill 0.35)
  Top 0.356: U6.27 28.18,10.39 v27.81,10.03
  Bottom 0.356: v27.81,10.03 24.13,13.72 24.13,21.72 C3.+
DAC_OUT2  (via drill 0.35)
  Top 0.356: U6.26 v28.58,11.04 v28.57,11.05
  Bottom 0.356: v28.57,11.05 27.81,11.05 24.89,13.97 24.89,35.56 C7.+
DAC_OUT3  (via drill 0.35)
  Top 0.356: U6.22 29.14,13.64 v29.08,13.59
  Bottom 0.356: v29.08,13.59 28.89,13.59 28.31,13.01 27.12,13.01 25.65,14.48 25.65,37.34 C11.+
DAC_OUT4  (via drill 0.35)
  Top 0.356: v28.07,13.59 28.26,13.59 28.97,14.29 U6.21
  Bottom 0.356: v28.07,13.59 27.56,13.59 26.42,14.73 26.42,35.81 29.46,38.86 C15.+
DAC_OUT5  (via drill 0.35)
  Top 0.356: U6.20 28.41,14.95 v28.07,14.61
  Bottom 0.356: v28.07,14.61 27.56,14.61 27.18,14.99 27.18,35.05 29.97,37.85 51.94,37.85 C19.+
DAC_OUT6  (via drill 0.35)
  Top 0.356: U6.19 28.6,15.6 v28.57,15.62
  Bottom 0.356: v28.57,15.62 28.32,15.62 27.94,16 27.94,33.78 31.52,37.36 52.79,37.36 55.43,40.01 C23.+
DAC_OUT7  (via drill 0.35)
  Top 0.356: U6.16 29.45,17.55 28.96,18.03 v28.96,19.81
  Bottom 0.356: v28.96,19.81 28.96,33.53 32.01,36.59 68.6,36.59 71.11,39.09 77.44,39.09 C27.+
DAC_OUT8  (via drill 0.35)
  Top 0.356: U6.15 29.97,18.78 v29.97,19.81
  Bottom 0.356: v29.97,19.81 29.97,32.77 33.31,36.1 68.8,36.1 71.31,38.61 93.85,38.61 C31.+
DAC_OUT9  (via drill 0.25)
  Top 0.356: U7.27 61.61,10.27 v61.34,10.54
  Bottom 0.356: v61.34,10.54 60.2,11.68 60.2,15.84 63.41,19.05 65.79,19.05 66.56,19.82 66.56,33.13 71.07,37.64 71.46,38.02 71.51,38.08 83.37,38.08 83.57,38.08 102.34,38.08 C35.+
DAC_OUT10  (via drill 0.35)
  Top 0.356: U7.26 62.23,10.92 62.18,10.92 v62.1,10.85
  Bottom 0.356: v62.1,10.85 60.71,12.25 60.71,15.67 63.58,18.54 66.45,18.54 69.45,21.54 69.45,35.33 71.71,37.59 120.45,37.59 121.67,38.81 C39.+
DAC_OUT11  (via drill 0.25, 0.35)
  Top 0.356: v61.37,13.65 61.5,13.52 U7.22
  Route2 0.356: C43.+ 128.78,39.37 v127.25,37.85
  Bottom 0.356: v61.37,13.65 61.21,13.81 61.21,15.49 63.75,18.03 66.63,18.03 69.93,21.34 69.93,35.05 71.12,36.24 71.94,37.06 126.47,37.06 v127.25,37.85
DAC_OUT12  (via drill 0.25, 0.35)
  Top 0.356: U7.21 62.17,14.17 v62.1,14.1
  Route2 0.356: v128.02,37.34 131.7,41.02 C47.+
  Bottom 0.356: v62.1,14.1 61.85,14.1 61.72,14.22 61.72,15.24 64.01,17.53 66.8,17.53 70.41,21.14 70.41,28.31 70.61,28.51 70.61,35.05 72.14,36.58 127.25,36.58 v128.02,37.34
EXT_OUT1
  Top 0.356: PL1.13 3.81,52.41 R1.2
EXT_OUT2
  Top 0.356: R8.2 8.92,61.6 PL1.12
EXT_OUT3
  Top 0.356: PL2.13 29.21,53.12 R9.2
EXT_OUT4
  Top 0.356: PL2.12 39.25,52.83 42.71,52.83 R16.2
EXT_OUT5
  Top 0.356: PL3.13 54.61,54.52 R17.2
EXT_OUT6
  Top 0.356: PL3.12 65.54,51.94 R24.2
EXT_OUT7
  Top 0.356: PL4.13 80.01,54.14 R25.2
EXT_OUT8
  Top 0.356: PL4.12 84.49,61.6 R32.2
EXT_OUT9
  Top 0.356: PL5.13 105.41,53.38 R33.2
EXT_OUT10
  Top 0.356: R40.2 110.65,61.6 PL5.12
EXT_OUT11
  Top 0.356: PL6.13 130.81,53.63 R41.2
EXT_OUT12
  Top 0.356: PL6.12 141.99,51.69 R48.2
GND  (via drill 0.35)
  Top 0.254: R102.2 59.56,23.5 v60.33,24.26 | R103.2 62.52,22.82 v62.61,22.73 | R105.2 61.76,26.89 v61.59,27.05 | R104.2 64.81,27.05 v65.66,27.05 | U7.14 69.72,18.4 v69.72,18.92 | R69.1 46.95,10.29 v47.88,10.29 | U6.14 35.4,18.2 v35.18,18.41 | C102.2 193.8,39.79 v193.8,40.13
  Top 0.356: LED2.C v135.25,25.15 | C71.2 193.04,27.43 v193.55,27.94 TC1.3 | C65.1 v153.67,26.92 | R52.2 157.65,32.6 v158.24,32 | C64.1 154.94,34.54 | 154.94,34.54 v153.92,34.54 | U3.120 158.09,40.08 157.74,40.43 156.16,40.43 C63.1 154.94,39.2 v154.94,38.35 | U3.130 157.77,35.08 156.45,36.4 155.97,36.4 155.63,36.05 155.63,35.23 154.94,34.54 | C62.1 156.46,47.75 v155.96,48.26 | v159.26,51.82 159.26,50.42 C55.1 161.24,48.43 161.99,48.43 162.17,48.25 162.17,47.47 U3.107 | U4.2 153.16,59.44 153.67,59.94 v153.73,59.89 | OSC1.2 161.48,56.64 v163.07,56.64 | C76.1 169.51,59.6 v169.67,59.44 | U3.94 168.68,49.77 169.75,50.83 169.75,51.55 169.41,51.89 168.67,51.89 C61.1 v168.15,53.59 | U3.85 173.18,49.7 173.53,50.04 173.53,51.61 C60.1 v172.72,53.59 | C72.1 177.68,54.49 v177.55,54.36 | R54.2 v181.1,54.61 | C59.1 183.98,49.19 v183.9,49.28 | C56.1 v185.17,45.72 | U3.61 182.63,40.08 182.88,39.84 184.45,39.84 C58.1 185.25,41.82 v185.17,41.91 | U3.51 182.55,35.08 182.88,34.76 184.45,34.76 C57.1 C75.1 185.25,38.7 v185.42,38.86 | U3.38 182.18,28.58 183.4,27.36 183.88,27.36 184.22,27.7 184.22,28.05 C54.1 185.25,28.11 v185.42,27.94 | U3.31 176.68,23.43 C68.1 174.41,22.26 v174.24,22.1 | C70.1 177.63,20.83 v176.02,20.83 | C69.1 180.51,20.99 v180.59,21.08 | C103.2 181.52,22.1 v181.1,22.1 | IC7.7 186.56,17.4 v186.18,17.02 | U3.16 169.18,24.7 169.12,24.64 169.12,23.07 C67.1 170.01,22.35 v170.94,22.35 | C66.1 164.68,22.1 v165.61,22.1 | C73.2 172.3,12.79 v172.47,12.95 | C74.1 174.41,12.79 v174.24,12.95 | C52.1 104.52,19.11 v104.52,17.65 | C53.1 106.87,17.72 v106.81,17.65 | C51.1 114.49,22.55 v114.68,22.73 | C100.1 v118.75,30.61
  Top 0.356: R96.2 120.78,28.32 v120.52,28.57 | R95.1 v122.05,7.75 | C99.1 v130.18,20.7 | C95.2 123.06,16.8 v123.06,17.65 | C97.2 130.81,14.99 v130.18,15.62 | C46.2 v142.75,42.29 | IC6.5 140.72,45.78 v140.72,45.09 | C48.1 137.41,44.49 v137.41,45.85 | IC6.3 137.03,47.24 v137.16,47.12 | C42.2 133.35,44.74 v133.35,43.81 | C44.2 v137.67,51.44 | C38.2 v117.98,42.16 | IC5.5 115.7,46.04 v115.7,45.21 | C40.1 112.48,44.96 v113.67,44.96 | IC5.3 112.27,47.37 v112.39,47.24 | C36.2 113.92,51.6 v113.92,52.83 | C34.2 v108.33,43.94 | C30.2 v91.82,42.27 | IC4.5 89.59,45.27 v89.53,45.21 | C32.1 86.83,43.94 v87,43.94 | IC4.3 84.52,47.24 v86.23,47.24 | C28.2 87.76,51.52 v87.76,50.29 | C26.2 v82.17,43.94 | v67.56,43.92 66.36,43.92 C22.2 | IC3.5 64.14,46.03 v64.14,45.34 | IC3.3 58.87,47.62 v60.33,47.62 | C20.2 62.14,50.46 v62.1,50.42 | C24.1 v61.59,44.83 | C18.2 56.77,45 v56.77,44.07 | C14.2 41.87,43.94 v43.05,43.94 | IC2.5 37.72,46.23 v37.59,46.35 | C12.2 36.36,50.2 v36.32,50.16 | IC2.3 34.36,47.62 v35.81,47.62 | C10.2 31.84,45.09 v30.99,45.09 | C89.- 56.01,8.26 | v47.88,8.13 R73.2 | C16.1 35.9,45.94 v36.07,46.1 | C82.- 34.92,5.44 v34.92,4.45 | R74.2 28.83,8.85 v28.83,9.53 | C6.2 17.49,44.07 v18.41,44.07 | IC1.5 13.59,46.35 v13.46,46.48 | C4.2 13.25,50.59 v13.21,50.55 | IC1.3 9.97,47.75 v11.43,47.75 | C8.1 11.68,45.12 v11.68,46.23 | C2.2 7.79,45.21 v8.64,45.21 | v19.94,8.51 19.96,8.49 C93.- 22.62,8.76 23.84,8.76 C85.1 27.79,11.09 28.88,12.18 30.39,12.18 U6.24 | U6.29 33.53,10.16 v33.66,10.03 | U6.18 27.25,16.25 C84.1 24.33,16.17 C83.- 23.35,17.14 v21.97,17.14 | U5.2 176.02,57.4 v175.64,57.78 | U6.10 36.65,15.75 C80.1 39.28,16.76 39.45,16.92 39.45,20.67 C87.- 39.61,22.12 v38.99,22.73
  Top 0.356: R65.1 37.85,27.69 v37.97,27.81 | R68.1 36.07,27.69 v36.2,27.81 | R72.1 34.29,27.69 v34.42,27.81 | U7.24 61.07,12.22 C91.1 57.11,8.26 56.01,8.26 | 56.01,8.26 v54.48,8.26 | U7.18 61.16,16.12 C90.1 60.92,15.88 v59.56,15.88 | U7.29 v66.42,10.03 | U7.10 72.33,15.47 C86.1 72.43,16.38 72.75,16.69 72.75,20.95 C81.- 74.06,21.99 v75.06,22.99 | R77.1 74.3,27.81 v74.55,28.07 | R83.1 72.52,27.81 v72.77,28.07 | R84.1 70.74,27.81 v70.99,28.07 | v59.05,8 60.74,8 R86.2 | C92.- 57.51,21.23 v57.53,21.21 | C78.1 R57.1 174.59,71.21 v174.75,71.37 | C79.1 R58.1 185.42,68.49 v185.42,67.31 | TC1.5 v194.06,26.67 | TC1.9 v194.09,24.13 | R85.2 v83.44,9.78 | C88.- v69.98,5.46
  Top 0.508: C101.1 v123.57,32.38 | C96.2 129.41,7.93 v129.41,6.73 | C98.2 v132.21,20.19 | C94.1 122.62,18.67 v121.54,18.67
  Top 1.016: C50.1 v144.65,28.7 | C49.1 145.74,27.94 v145.92,27.94 | U1.1 137.8,21.22 C77.- 138.3,19.42 v138.3,18.8 v138.3,18.03 v138.3,17.27 v138.3,16.51 v138.3,15.75
  other vias: 20.7,8.51
  pour Route2 (rank 6): -17.78,101.35 227.58,101.35 227.58,-14.99 -2.79,-14.99 -17.78,0
  pour Route15 (isolate 0.508, rank 6): -6.6,87.63 -6.6,-0.25 0.51,-7.37 202.44,-7.37 206.76,-3.05 206.76,86.61 201.93,91.44 -3.05,91.44 -6.86,87.63
I2C_SCL  (via drill 0.25, 0.35)
  Top 0.254: U3.139 161.19,30.58 v161.29,30.48 | R70.1 46.57,12.05 48.77,14.25 48.77,20.32 v49.4,20.95 | R81.1 83.06,14.39 83.06,20.57 v83.83,21.34 v83.83,21.35
  Top 0.356: R93.1 160.27,24.64 v160.78,25.15
  Route2 0.254: v49.4,20.95 57.03,20.95 57.31,20.68 82.4,20.68 83.08,21.35 v83.83,21.35
  Bottom 0.254: v161.29,30.48 161.54,30.23 161.54,25.91 | v160.78,25.15 161.54,25.91 | v83.83,21.35 v83.83,21.36 89.26,21.36 92.18,21.36 108.84,4.7 146.81,4.7 161.54,19.43 161.54,25.91
I2C_SDA  (via drill 0.25, 0.35)
  Top 0.254: U3.137 161.46,31.58 v161.54,31.5 | v160.02,25.65 158.5,24.13 R92.1 158.2,23.84 v157.48,23.11 | R71.1 48.39,15.28 48.39,20.95 v49.15,21.72 | R82.1 82,20.28 v83.82,22.1
  Route2 0.254: v49.15,21.72 57.29,21.72 57.31,21.74 82.45,21.74 82.8,22.1 v83.82,22.1
  Route15 0.254: v161.54,31.5 162.05,30.99 162.05,27.69 v160.02,25.65
  Bottom 0.254: v157.48,23.11 157.48,22.59 157.76,22.32 159.77,22.32 161.04,21.05 161.04,19.68 146.43,5.08 109,5.08 91.98,22.1 v83.82,22.1
I2S_CKIN
  Top 0.254: U3.99 166.18,50.64 R56.2
LED1
  Top 0.254: R98.2 152.53,67.94 149.61,65.02 149.61,49.24 154.26,44.58 155.26,44.58 155.7,44.58 U3.111
LED2
  Top 0.254: R99.2 150.75,66.71 149.22,65.18 149.22,65.15 149.1,65.02 149.1,49.21 154.22,44.08 U3.112
LED3
  Top 0.254: R100.2 148.97,65.47 148.72,65.21 148.72,48.9 154.03,43.58 U3.113
LED4
  Top 0.254: U3.47 185.99,33.08 189.99,37.08 189.99,39.34 190.79,40.14 R101.1
N$1
  Top 0.254: IC1.2 7.83,48.9 C1.2 R2.2
N$2
  Top 0.254: IC1.1 7.83,50.16 C1.1 7,50.38 6.19,51.18 4.98,51.18 4.18,50.38 R3.2
  Top 0.356: R1.1 2.2,51.74 R3.2
N$3
  Top 0.254: R2.1 3.89,48.68 R3.1 3.56,48.6 R4.1 5.26,47.08 C2.1
N$4
  Top 0.356: C3.- 3.56,46.9 R4.2
N$5
  Top 0.254: IC1.6 17.06,47.62 C5.2 18.97,49.11 R5.2
N$6
  Top 0.254: IC1.7 17.06,48.9 C5.1 17.89,49.11 18.7,49.91 20.53,49.91 R6.2
  Top 0.356: R8.1 21.34,50.89 R6.2
N$7
  Top 0.254: C6.1 19.13,45.55 | 19.13,45.55 R7.1 | 19.13,45.55 19.3,45.73 R5.1 R6.1
N$8
  Top 0.356: C7.- 20.83,45.38 R7.2
N$9
  Top 0.254: IC2.2 32.22,48.77 C9.2 R10.2
N$10
  Top 0.254: IC2.1 32.22,50.04 C9.1 31.38,50.25 30.58,51.06 29.37,51.06 28.56,50.25 R11.2
  Top 0.356: R11.2 26.58,51.61 R9.1
N$11
  Top 0.254: R10.1 28.27,48.55 R11.1 27.94,48.48 R12.1 29.64,46.95 C10.1
N$12
  Top 0.356: C11.- 27.81,46.82 R12.2
N$13
  Top 0.254: IC2.6 41.44,47.5 C13.2 43.36,48.98 R13.2
N$14
  Top 0.254: IC2.7 41.44,48.77 C13.1 42.28,48.98 43.08,49.79 44.92,49.79 R14.2 45.72,48.77
  Top 0.356: R16.1 45.72,51.52 45.72,48.77
N$15
  Top 0.254: C14.1 43.51,45.43 | 43.51,45.43 R15.1 | 43.51,45.43 43.69,45.6 R13.1 R14.1
N$16
  Top 0.254: 45.32,45.36 R15.2
  Top 0.356: C15.- 45.34,45.34 45.32,45.36
N$17
  Top 0.254: IC3.2 56.73,48.77 C17.2 R18.2
N$18
  Top 0.254: IC3.1 56.73,50.04 C17.1 55.89,50.25 55.09,51.06 53.88,51.06 53.07,50.25 R19.2
  Top 0.356: R19.2 50.59,52.12 R17.1
N$19
  Top 0.254: R18.1 52.78,48.55 R19.1 52.45,48.48 R20.1 54.15,46.95 C18.1
N$20
  Top 0.356: C19.- 52.7,46.52 R20.2
N$21
  Top 0.254: IC3.6 65.95,47.5 C21.2 67.87,48.98 R21.2
N$22
  Top 0.254: IC3.7 65.95,48.77 C21.1 66.79,48.98 67.59,49.79 69.43,49.79 R22.2
  Top 0.356: R22.2 70.23,51.78 R24.1
N$23
  Top 0.254: C22.1 68.02,45.43 | 68.02,45.43 R23.1 | 68.02,45.43 68.2,45.6 R21.1 R22.1
N$24
  Top 0.356: C23.- 69.72,45.25 R23.2
N$25
  Top 0.254: IC4.2 82.38,48.64 C25.2 R26.2
N$26
  Top 0.254: IC4.1 82.38,49.91 C25.1 81.55,50.13 80.74,50.93 79.53,50.93 78.73,50.13 R27.2
  Top 0.356: R27.2 76.24,51.99 R25.1
N$27
  Top 0.254: R26.1 78.44,48.43 R27.1 78.11,48.35 R28.1 79.81,46.82 C26.1
N$28
  Top 0.356: C27.- 77.98,46.7 R28.2
N$29
  Top 0.254: IC4.6 91.61,47.37 C29.2 93.52,48.86 R29.2
N$30
  Top 0.254: IC4.7 91.61,48.64 C29.1 92.44,48.86 93.25,49.66 95.08,49.66 R30.2
  Top 0.356: R32.1 95.97,48.94 R30.2
N$31
  Top 0.254: C30.1 93.68,45.3 | 93.68,45.3 R31.1 | 93.68,45.3 93.85,45.48 R29.1 R30.1
N$32
  Top 0.356: C31.- 95.47,42.25 R31.2
N$33
  Top 0.254: IC5.2 108.55,48.64 C33.2 R34.2
N$34
  Top 0.254: IC5.1 108.55,49.91 C33.1 107.71,50.13 106.9,50.93 105.69,50.93 104.89,50.13 R35.2
  Top 0.356: R35.2 102.4,51.99 R33.1
N$35
  Top 0.254: R34.1 104.6,48.43 R35.1 104.27,48.35 R36.1 105.97,46.82 C34.1
N$36
  Top 0.356: R36.2 104.18,41.95 C35.-
N$37
  Top 0.254: IC5.6 117.77,47.37 C37.2 119.68,48.86 R37.2
N$38
  Top 0.254: IC5.7 117.77,48.64 C37.1 118.61,48.86 119.41,49.66 121.24,49.66 R38.2 122.05,51.9 R40.1
N$39
  Top 0.254: C38.1 119.84,45.3 | 119.84,45.3 R39.1 | 119.84,45.3 120.02,45.48 R37.1 R38.1
N$40
  Top 0.356: R39.2 121.67,45.17 C39.-
N$41
  Top 0.254: IC6.2 133.31,48.51 C41.2 R42.2
N$42
  Top 0.254: IC6.1 133.31,49.78 C41.1 132.47,50 131.67,50.8 130.46,50.8 129.66,50 R43.2 | R41.1 127.42,52.07
  Top 0.356: R43.2 127.42,51.61 127.42,52.07
N$43
  Top 0.254: R42.1 129.36,48.3 R43.1 129.03,48.22 R44.1 130.73,46.7 C42.1
N$44
  Top 0.356: R44.2 128.94,44.36 C43.-
N$45
  Top 0.254: IC6.6 142.53,47.24 C45.2 144.45,48.73 R45.2
N$46
  Top 0.254: IC6.7 142.53,48.51 C45.1 143.37,48.73 144.18,49.53 146.01,49.53 R46.2
  Top 0.356: R46.2 146.81,51.27 R48.1
N$47
  Top 0.254: C46.1 144.6,45.17 | 144.6,45.17 R47.1 | 144.6,45.17 144.78,45.35 R45.1 R46.1
N$48
  Top 0.356: R47.2 142.33,41.02 C47.-
N$49
  Top 0.254: R49.1 135.38,28.61 LED2.A
N$50
  Top 0.254: U1.3 135.51,31.96 R49.2
  Top 1.016: TP1.TP 148.38,25.49 L1.1 151.51,28.06 147.63,31.94 C50.2 140.11,31.94 U1.3
N$52
  Top 0.508: L7.2 115.44,26.21 U2.1
N$53
  Top 0.508: U2.5 JP6.5
N$54
  Top 0.508: U2.6 JP6.7
N$55
  Top 0.508: U2.4 JP6.3
N$56
  Top 0.508: JP6.1 110.55,24.45 C51.2 113.9,24.45 115.34,23 115.34,22.41 L7.1
N$57
  Top 0.356: U3.71 183.27,45.08 183.39,44.96 183.77,45.34 C56.2
N$58
  Top 0.356: U3.106 162.67,47.47 162.67,48.44 162.18,48.92 C55.2
N$59
  Top 0.254: U3.143 156.93,28.58 R50.2
N$60
  Top 0.254: U3.138 157.57,31.08 157.39,30.9 R52.1 R51.1
N$61
  Top 0.254: U3.75 178.18,48.29 180.31,50.42 180.85,50.42 181.1,50.67 R54.1
N$62
  Top 0.356: U3.76 177.68,49.16 179.07,50.55 C72.2
N$63
  Top 0.254: OSC1.1 161.14,61.56 R55.1
N$64
  Top 0.254: R56.1 166.12,56.2 OSC1.3
N$66
  Top 0.254: U3.2 162.18,11.39 156.26,5.46 99.95,5.46 94.61,10.79 94.61,32.38 91.82,35.18 R88.1
N$67
  Top 0.254: USB_FS.P$1 USB_FS.P$2 169.85,70.94 171.28,69.51 R57.2 C78.2
N$68
  Top 0.254: R89.1 92.58,33.4 94.11,31.88 94.11,10.67 99.82,4.95 156.46,4.95 162.68,11.17 U3.3
N$69
  Top 0.254: C79.2 R58.2 184.42,70.45 184.33,70.36 | USB_HS.M2 USB_HS.M4
  Top 0.356: USB_HS.M3 184.33,70.36 USB_HS.M1 183.44,73.66 179.78,73.66 USB_HS.M4
N$70
  Top 0.254: U3.4 163.18,13.94 163.19,13.93 163.19,10.92 156.59,4.32 99.69,4.32 93.6,10.41 93.6,30.48 92.46,31.62 R90.1
N$71
  Top 0.254: U3.5 163.68,15.22 163.7,15.2 163.7,10.79 156.72,3.81 99.44,3.81 93.09,10.16 93.09,29.46 92.71,29.84 R91.1
N$72
  Top 0.508: IC10.4 IC10.2 127.22,12.32 R94.2 D2.A 128.54,14.79 D1.C 129.97,13.91 C97.1 133.9,12.19 L5.1
N$73
  Top 0.508: IC10.1 125.09,9.8 125.09,7.91 R95.2 125.18,8 C96.1 127.38,8.07 R94.1 129.18,10.45 D1.A
N$75
  Top 0.356: U6.1 43.25,9.74 R73.1
N$76
  Top 0.356: U6.28 30.56,8.88 R74.1
N$77
  Top 0.356: U6.2 44.38,10.39 R69.2
N$79
  Top 0.356: U6.25 31.74,11.7 31.88,11.56 31.88,6.5 C82.+
N$80
  Top 0.356: U6.23 26.37,12.99 C85.2 25.96,12.59 C93.+ | U6.17 28.15,16.89 C84.2 23.82,21.23 23.5,21.23 C83.+
  Top 1.016: C93.+ 22.35,14.82 L3.2 22.19,15.41 21.06,16.54 21.06,18.79 23.5,21.23
N$81
  Top 0.356: U6.7 41.33,13.64 42.55,14.86 42.55,23.66 R63.2
N$82
  Top 0.356: U6.6 41.44,12.99 43.05,14.61 43.05,24.68 R64.2
N$83
  Top 0.356: U6.11 38.09,16.25 38.96,17.12 38.96,20.73 37.85,21.84 R65.2
N$84
  Top 0.356: U6.8 41.26,14.29 42.04,15.07 42.04,23.4 41.72,23.72 40.71,23.72 R66.2
N$85
  Top 0.356: U6.12 37.98,16.89 38.48,17.4 38.48,20.45 36.2,22.73 36.2,24.68 R68.2
N$86
  Top 0.356: R72.2 34.16,24.68 34.16,23.75 37.97,19.94 37.97,17.91 37.61,17.55 U6.13
N$87
  Top 0.508: D3.C 128.91,29.41 128.05,30.26 | 128.05,30.26 D4.A 127.96,32.19 C101.2 128.91,31.24 L6.1 | IC11.3 127.69,28.28 R97.1 127.72,29.93 128.05,30.26
N$88
  Top 0.508: C100.2 124.01,30.61 D4.C | IC11.1 127.69,21.48 126.19,22.98 126.19,28.16 R97.2 124.26,30.08 D4.C | D4.C 124.26,29.18 R96.1
N$89
  Top 0.356: U6.5 41.55,12.35 43.56,14.35 43.56,23.41 R67.2
N$91
  Top 0.356: U6.3 44.23,11.04 R70.2
N$92
  Top 0.356: U6.4 43.1,11.7 R71.2
N$96
  Top 0.254: R99.1 150.75,72.69 152.08,74.03 152.08,75.38 LED1.A2
N$97  (via drill 0.35)
  Top 0.254: R102.1 59.56,19.41 v59.05,18.91 | v59.08,14.61 59.21,14.73 61.98,14.73 62.06,14.82 U7.20
  Route15 0.254: v59.05,18.91 v59.05,17.14
  Bottom 0.254: v59.05,17.14 58.57,16.66 58.57,15.11 v59.08,14.61
N$98  (via drill 0.35)
  Top 0.254: U7.19 61.92,15.47 61.69,15.24 59.2,15.24 58.78,15.65 58.78,16.09 59.09,16.41 59.6,16.41 59.82,16.62 v59.82,17.14 | R103.1 61.34,20.19 v60.07,18.92
  Route15 0.254: v60.07,18.92 60.07,17.4 v59.82,17.14
N$99
  Top 0.254: R104.1 64.64,17.84 64.22,17.42 U7.16
N$100
  Top 0.254: R105.1 62.87,23.23 63.14,22.95 63.14,22.51 62.69,22.06 62.69,18.83 U7.15
N$101
  Top 0.356: R85.1 75.22,9.78 75.06,9.62 U7.1
N$102
  Top 0.356: R86.1 63.45,9.01 U7.28
N$103
  Top 0.356: C88.+ 64.64,5.46 64.64,11.22 64.3,11.57 U7.25
N$104
  Top 0.356: C89.+ 56.01,12.57 59.73,12.57 C91.2 60.12,12.87 U7.23 | U7.17 62.06,16.77 C90.2
  Top 0.762: C90.2 60.33,17.74 60.14,17.93 56.81,17.93 C92.+
  Top 1.016: 56.01,12.57 56.43,12.99 L4.2 56.01,15.28 C92.+
N$105
  Top 0.356: U7.7 71.1,13.52 71.3,13.32 74.75,13.32 77.85,16.42 R75.2
N$106
  Top 0.356: R76.2 79.63,17.51 74.95,12.84 71.1,12.84 71.07,12.87 U7.6
N$107
  Top 0.356: U7.11 71.49,16.12 72.26,16.89 72.26,23.75 72.59,24.08 73.14,24.08 74,24.93 R77.2
N$108
  Top 0.356: U7.8 71.13,14.17 71.5,13.8 74.55,13.8 76.07,15.32 R78.2
N$109
  Top 0.356: R79.2 81.41,18.61 75.02,12.22 U7.5
N$110
  Top 0.356: R80.2 79.01,10.27 U7.2
N$111
  Top 0.356: U7.3 77.89,10.92 R81.2
N$112
  Top 0.356: R82.2 76.76,11.57 U7.4
N$117
  Top 0.356: U7.12 71.12,16.77 71.75,17.4 71.75,24.17 R83.2
N$118
  Top 0.356: R84.2 71.12,24.55 71.12,17.78 70.76,17.42 U7.13
N$119
  Top 0.254: LED1.A3 152.08,77.92 150.74,77.92 148.97,76.15 R100.1
N$120
  Top 0.254: R98.1 152.53,73.28 LED1.A1
N$121
  Top 0.254: U$1.LED+ 194.54,60 195.68,58.85 195.68,43.7 R101.2
NRST  (via drill 0.35)
  Top 0.254: TC1.10 195.57,23.48 195.57,22.44 194.98,21.86 194.15,21.86 193.56,22.44 193.56,24.03 C71.1 R53.1 190.33,24.55 v189.99,24.89 | v175.01,28.19 174.24,28.19 173.68,27.63 U3.25
  Bottom 0.254: v189.99,24.89 183.9,24.89 180.59,28.19 v175.01,28.19
OSC_IN
  Top 0.254: U3.23 172.68,17.7 Y1.1 170.73,11.82 C73.1
OSC_OUT
  Top 0.254: U3.24 173.18,18.8 Y1.2 176.23,11.81 C74.2
PUSHBTN
  Top 0.254: U3.46 181.13,32.65 186.09,32.65 190.37,36.92 190.37,38.06 C102.1 191.05,39.36 191.6,39.91 191.6,51.82 192.68,52.91 192.68,54.02 192.77,54.11 | 192.77,54.11 U$1.P$5 | U$1.P$2 192.77,54.65 192.77,54.11
SAI_BCK  (via drill 0.35)
  Top 0.356: R75.1 v77.85,28.32 | v78.11,30.86 78.87,31.62 | R63.1 46.52,31.62 48.64,31.62 | 78.87,31.62 TP9.TP 48.64,31.62 | R79.1 v81.41,28.07 | R90.2 82.17,31.62 | v81.41,30.86 82.17,31.62 | 82.17,31.62 78.87,31.62 | R67.1 47.88,29.43 47.88,30.86 48.64,31.62
  Bottom 0.356: v77.85,28.32 77.85,30.61 v78.11,30.86 | v81.41,30.86 v81.41,28.07
SAI_DATA1  (via drill 0.35)
  Top 0.356: R91.2 67.94,29.84 | 67.94,29.84 v49.4,29.84 | v47.12,29.84 44.63,27.36 44.33,27.36 43.48,26.5 R64.1 | TP10.TP 67.94,29.84
  Bottom 0.356: v49.4,29.84 v47.12,29.84
SAI_DATA2  (via drill 0.35)
  Top 0.356: R88.2 87.16,34.92 TP7.TP | R76.1 v79.63,28.32
  Bottom 0.356: TP7.TP 79.63,34.16 v79.63,28.32
SAI_LRCK  (via drill 0.35)
  Top 0.356: R78.1 v76.07,28.32 | R66.1 46.52,33.4 TP8.TP R89.2
  Bottom 0.356: TP8.TP 76.07,33.15 v76.07,28.32
SPI_CLK
  Top 0.254: U3.41 186.33,30.08 186.57,29.84 IC7.2
SPI_CS_FLASH
  Top 0.254: U3.44 180.99,31.51 180.28,31.51 179.71,30.94 179.71,27.68 180.15,27.24 182.55,27.24 IC7.4
SPI_MISO
  Top 0.254: U3.42 186.59,30.58 187.2,29.97 187.2,19.58 IC7.8
SPI_MOSI
  Top 0.254: IC7.1 187.83,29.88 186.63,31.08 U3.43
SWCLK  (via drill 0.35)
  Top 0.254: TC1.4 196.22,28.29 196.96,29.04 196.96,32.65 v195.83,33.78 | U3.109 161.18,45.58 v162.05,44.7
  Bottom 0.254: v195.83,33.78 195.05,34.57 194.6,34.57 194.58,34.54 171.97,34.54 167.36,39.15 167.36,39.39 v162.05,44.7
SWDIO  (via drill 0.35)
  Top 0.254: TC1.2 196.22,29.7 196.58,30.06 196.58,32.27 v194.82,34.04 | v163.58,41.91 163.18,42.3 U3.105
  Bottom 0.254: v194.82,34.04 171.45,34.04 v163.58,41.91
SWO  (via drill 0.35)
  Top 0.254: TC1.6 197.36,27.81 v197.36,27.94 | U3.133 162,33.58 v162.05,33.53
  Bottom 0.254: v197.36,27.94 197.36,32.26 196.37,33.25 194.85,33.25 194.58,33.53 v162.05,33.53
UART_RX  (via drill 0.35)
  Top 0.254: TC1.8 198.12,27.3 v198.12,28.45 | U3.122 168.18,39.08 v168.4,38.86
  Bottom 0.254: v198.12,28.45 198.12,32.51 195.58,35.05 172.21,35.05 v168.4,38.86
UART_TX  (via drill 0.35)
  Top 0.254: v194.06,25.91 194.56,25.4 TC1.7 | U3.119 167.45,40.58 v167.89,40.13
  Bottom 0.254: v167.89,40.13 172.21,35.81 196.6,35.81 198.65,33.76 198.65,27.2 197.36,25.91 v194.06,25.91
USB_DEV_CONN_N
  Top 0.152: USB_FS.2 164.23,70.81 164.08,70.81 163.96,70.69 163.96,68.4 162.69,67.13 154.25,67.13 153.29,66.17 153.29,65.66 153.84,65.11 R61.2
USB_DEV_CONN_P
  Top 0.152: USB_FS.3 164.23,71.12 163.96,71.12 163.65,70.81 163.65,68.53 162.56,67.44 154.13,67.44 152.98,66.29 152.98,65.66 152.49,65.16 152.15,65.16
  Top 0.356: 152.15,65.16 R62.2
USB_DEV_N
  Top 0.152: R61.1 154.18,61.73 U4.4
USB_DEV_P
  Top 0.152: U4.6 152.21,63.35
  Top 0.356: 152.21,63.35 R62.1
USB_FS_N
  Top 0.152: U4.3 154.11,57.84 153.31,57.04 153.31,56.62 156.29,53.65 162.94,53.65 164.13,52.45 164.13,47.5 U3.103
USB_FS_P
  Top 0.152: U4.1 152.21,57.84 153.01,57.04 153.01,56.49 156.16,53.34 162.81,53.34 163.83,52.32 163.83,48.27 163.78,48.22 163.78,47.55 U3.104
USB_HOST_CONN_N
  Top 0.152: R59.2 176.78,63.68 177.11,64.01 182.12,64.01 183.06,64.95 183.06,68.58 182.44,69.19 182.25,69.19 181.61,69.83 USB_HS.P$2
USB_HOST_CONN_P
  Top 0.152: R60.2 175.01,63.68 175.64,64.31 181.99,64.31 182.75,65.08 182.75,68.45 182.32,68.89 182.25,68.89 181.61,68.25 USB_HS.P$3
USB_HOST_N
  Top 0.152: U5.4 176.97,60.94 R59.1
USB_HOST_P
  Top 0.152: R60.1 175.07,61.06 U5.6
USB_HS_N
  Top 0.152: U5.3 176.97,55.55 176.17,54.75 176.17,52.81 176.91,52.07 | 176.91,52.07 | 176.91,52.07 177,51.98 177,48.31 177.09,48.22 177.09,47.55 U3.77
USB_HS_P
  Top 0.152: U5.1 175.07,55.55 175.87,54.75 175.87,52.68 176.69,51.85 176.69,48.3 176.66,48.26 176.66,47.48 U3.78

## Text on the board
tNames: Eran Rundstein | DT Breakout Box | Rev B, Dec 2020 | Designed by: | Pulsar Heavy Industries